# EasyEDA schematic 1-Schematic_EE463_Project.json
TITLE: DC Motor Drive; REV: 2.1; Date: 2022-02-06; Sheet: 1/1; Drawn By: zehragunes.13; Company: Enjin Drivers
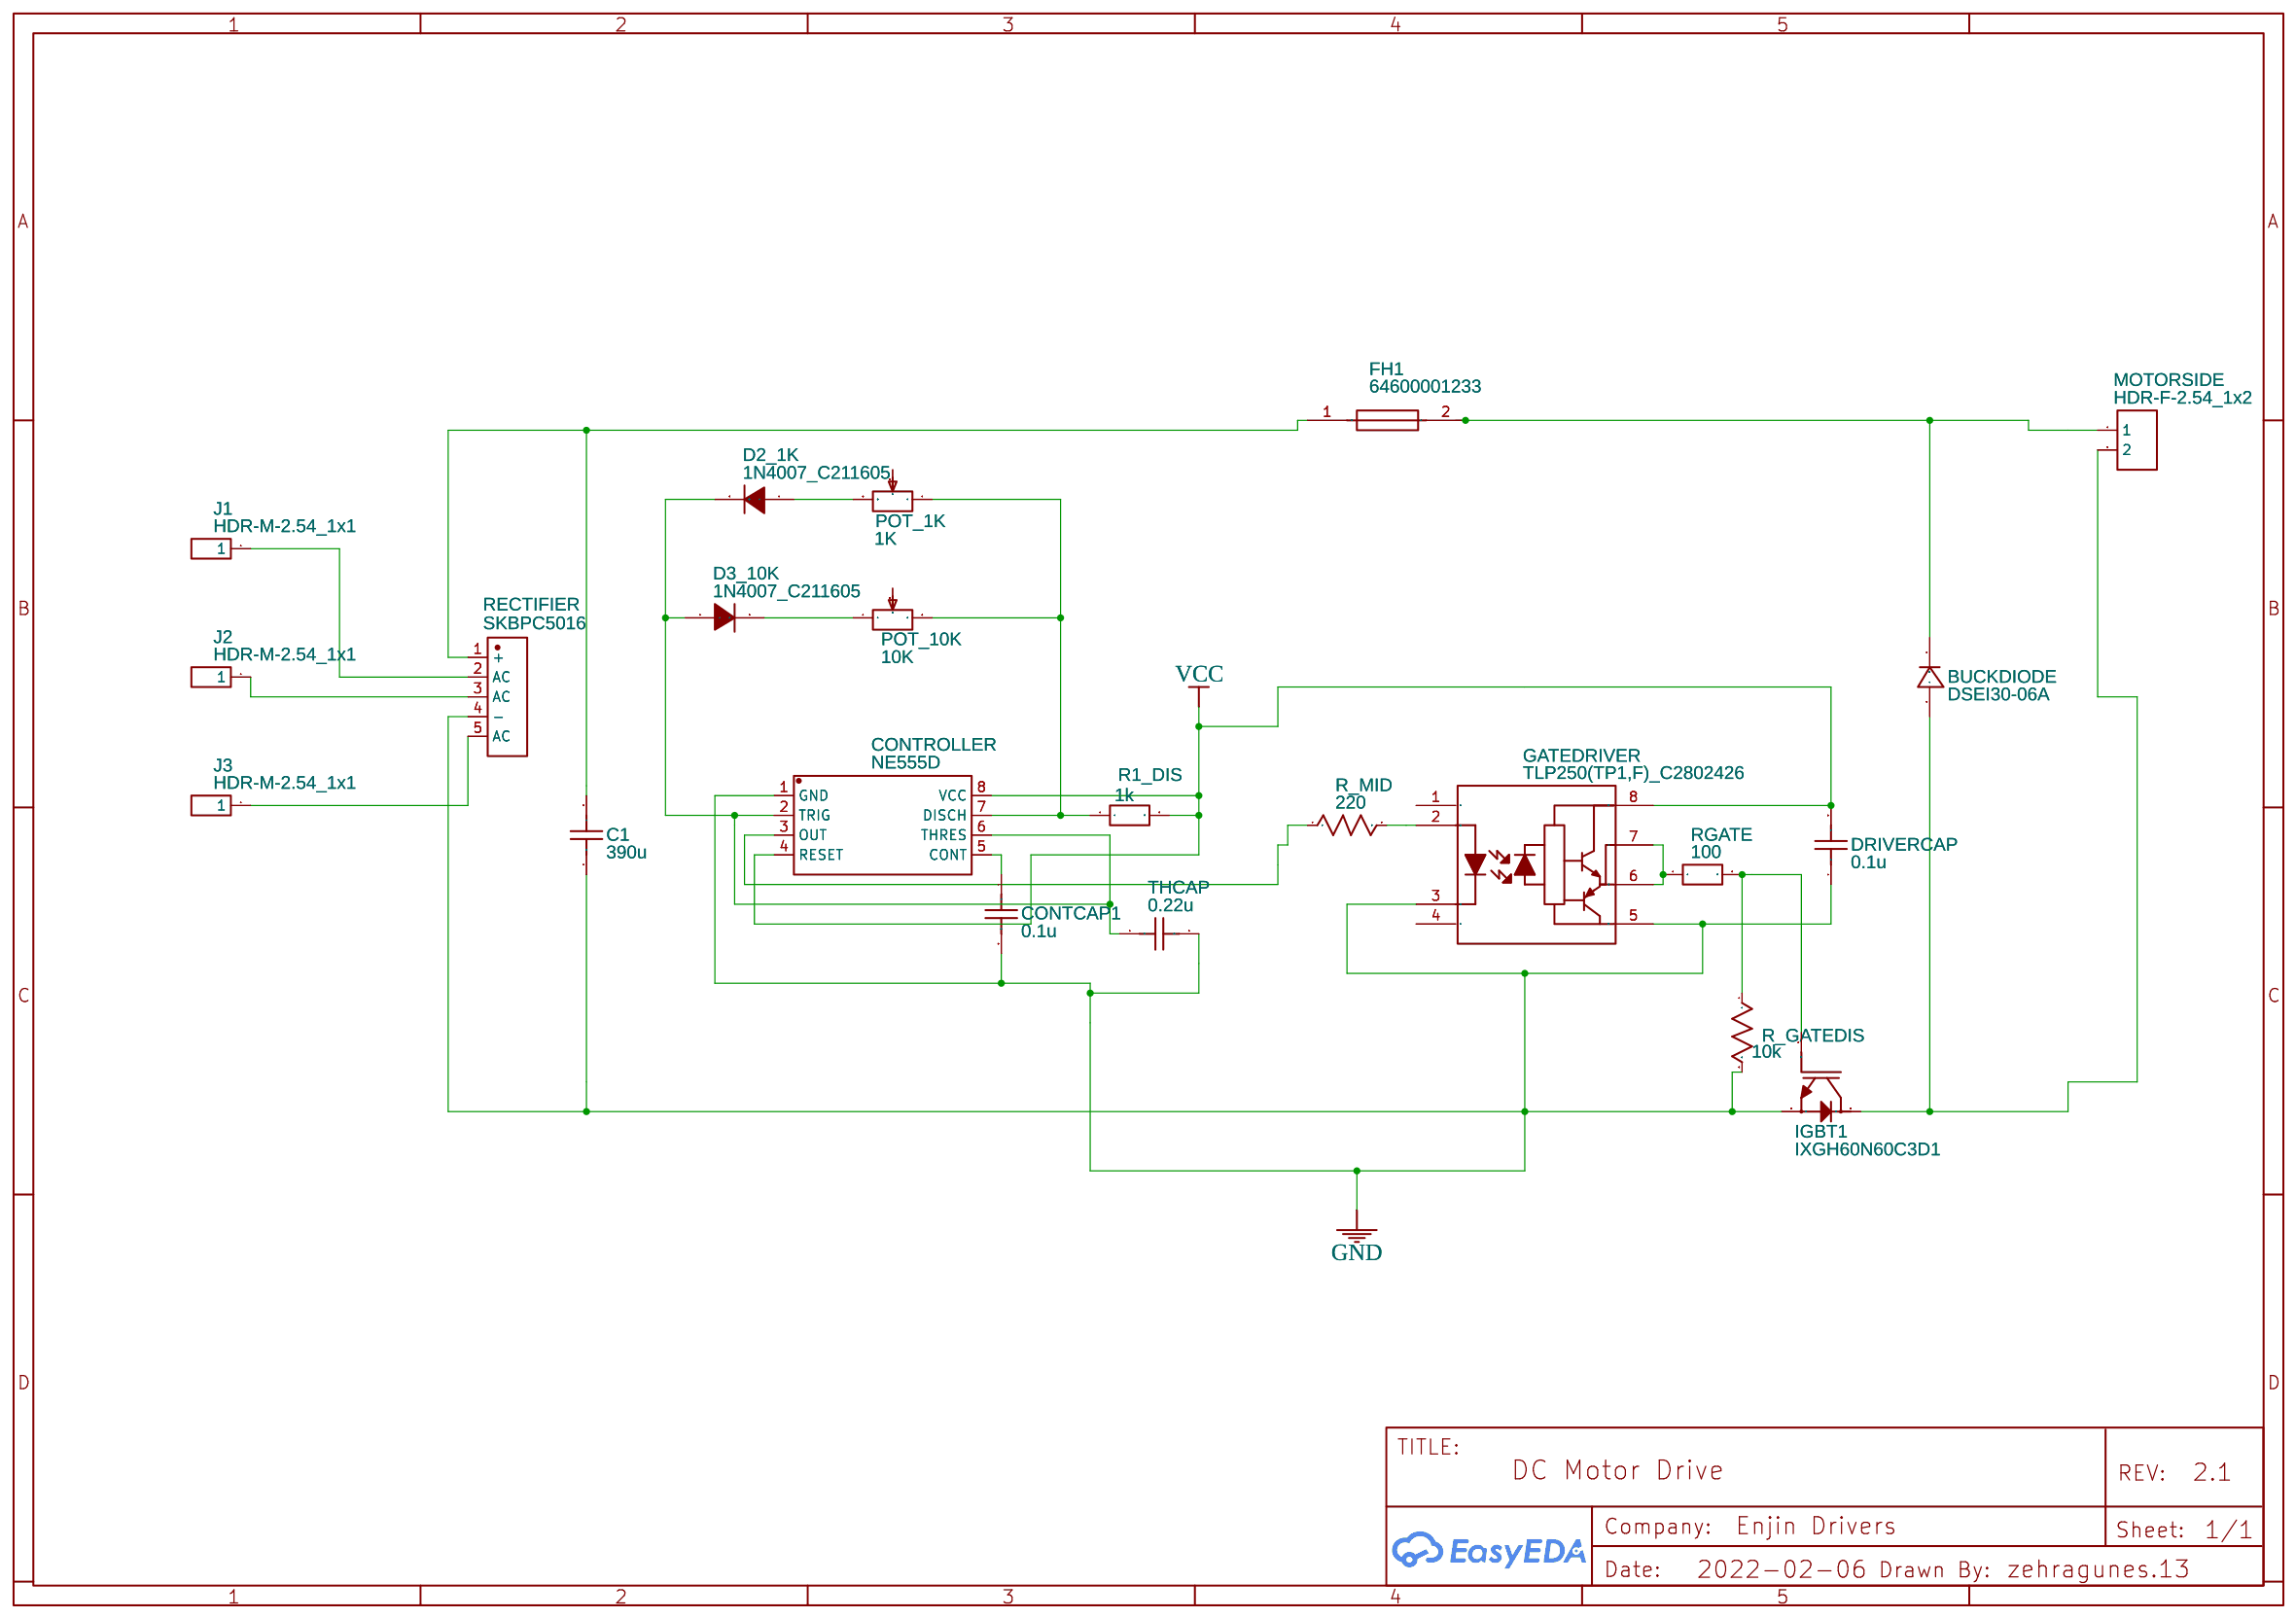
[diagram p0: schematic sheet]

## Parts
BUCKDIODE  DSEI30-06A  [TO-247-2_L15.8-W5.0-P10.92-L]
C1  390u  [C0603]
CONTCAP1  0.1u  [C0603]
CONTROLLER  NE555D  [SOIC-8_L5.0-W4.0-P1.27-LS6.0-BL]
D2_1K  1N4007_C211605  [DO-41_BD2.4-L4.7-P8.70-D0.9-FD]
D3_10K  1N4007_C211605  [DO-41_BD2.4-L4.7-P8.70-D0.9-FD]
DRIVERCAP  0.1u  [C0603]
FH1  64600001233  [FUSE-TH_64600001233]
GATEDRIVER  TLP250(TP1,F)_C2802426  [OPTO-SMD-8P_L9.6-W6.5-P2.54-LS10.0-BL]
IGBT1  IXGH60N60C3D1  [TO-247-3_L15.9-W5.1-P5.44-L]
J1  HDR-M-2.54_1x1  [HDR-M-2.54_1X1]
J2  HDR-M-2.54_1x1  [HDR-M-2.54_1X1]
J3  HDR-M-2.54_1x1  [HDR-M-2.54_1X1]
MOTORSIDE  HDR-F-2.54_1x2  [HDR-F-2.54_1X2]
POT_1K  1K  [RES-ADJ-SMD_EVM3X3]
POT_10K  10K  [RES-SMD_EVM2GS]
R1_DIS  1k  [R0201]
R_GATEDIS  10k  [R0603]
R_MID  220  [R0603]
RECTIFIER  SKBPC5016  [DIO-BG-TH_SKBPC5016]
RGATE  100  [R0201]
THCAP  0.22u  [C0603]

## Library data of the parts
BUCKDIODE = DSEI30-06A: Supplier: LCSC; Supplier Part: C424091; Manufacturer: IXYS; Contributor: LCSC; JLCPCB Part Class: Extended Part
C1 CONTCAP1 DRIVERCAP THCAP = C_0603_US: Contributor: LCEDA_Lib
CONTROLLER = NE555D: Supplier: LCSC; Supplier Part: C234230; Manufacturer: Texas Instruments; Contributor: LCSC; JLCPCB Part Class: Extended Part
D2_1K D3_10K = 1N4007_C211605: Supplier: LCSC; Supplier Part: C211605; Manufacturer: Yangzhou Yangjie Elec Tech; Manufacturer Part: 1N4007; Contributor: LCSC; JLCPCB Part Class: Extended Part
FH1 = 64600001233: Supplier: LCSC; Supplier Part: C2760106; Manufacturer: Littelfuse(美国力特); JLCPCB Part Class: Extended Part; Contributor: LCSC
GATEDRIVER = TLP250(TP1,F)_C2802426: Supplier: LCSC; Supplier Part: C2802426; Manufacturer: TOSHIBA(东芝); Manufacturer Part: TLP250(TP1,F); Contributor: LCSC; JLCPCB Part Class: Extended Part
IGBT1 = IXGH60N60C3D1: Supplier: LCSC; Supplier Part: C497181; Manufacturer: IXYS; Contributor: LCSC; JLCPCB Part Class: Extended Part
J1-J3 = HDR-M-2.54_1x1: Supplier Part: C81276; Supplier: LCSC; Contributor: LCEDA_Lib
MOTORSIDE = HDR-F-2.54_1x2: Supplier Part: C49661; Supplier: LCSC; Contributor: LCEDA_Lib
POT_1K = EVM3ESX50B13: Supplier: LCSC; Manufacturer: PANASONIC; Supplier Part: C11952
POT_10K = EVM2GSX80B14: Supplier: LCSC; Manufacturer: PANASONIC; Supplier Part: C72381
R1_DIS RGATE = R_0201_EU: Contributor: LCEDA_Lib
R_GATEDIS R_MID = R_0603_US: Contributor: LCEDA_Lib
RECTIFIER = SKBPC5016: Supplier: LCSC; Supplier Part: C781432; Manufacturer: YANGJIE(扬杰); JLCPCB Part Class: Extended Part; Contributor: LCSC

## Nets
GND: C1.1 CONTCAP1.2 CONTROLLER.1(GND) DRIVERCAP.1 GATEDRIVER.3 GATEDRIVER.5(GND) IGBT1.3(E) R_GATEDIS.2 RECTIFIER.4(-) THCAP.2
VCC: CONTROLLER.4(RESET) CONTROLLER.8(VCC) DRIVERCAP.2 GATEDRIVER.8(VCC) R1_DIS.2
Net-(BUCKDIODE-1): BUCKDIODE.1(C) FH1.2 MOTORSIDE.1
Net-(BUCKDIODE-3): BUCKDIODE.3(A) IGBT1.2(C) MOTORSIDE.2
Net-(C1-2): C1.2 FH1.1 RECTIFIER.1(+)
Net-(CONTCAP1-1): CONTCAP1.1 CONTROLLER.5(CONT)
Net-(CONTROLLER-2): CONTROLLER.2(TRIG) CONTROLLER.6(THRES) D2_1K.2(C) D3_10K.1(A) THCAP.1
Net-(CONTROLLER-3): CONTROLLER.3(OUT) R_MID.1
Net-(CONTROLLER-7): CONTROLLER.7(DISCH) POT_1K.1 POT_10K.3 R1_DIS.1
Net-(D2_1K-1): D2_1K.1(A) POT_1K.3
Net-(D3_10K-2): D3_10K.2(C) POT_10K.1
Net-(GATEDRIVER-2): GATEDRIVER.2 R_MID.2
Net-(GATEDRIVER-6): GATEDRIVER.6 GATEDRIVER.7 RGATE.1
Net-(IGBT1-1): IGBT1.1(G) R_GATEDIS.1 RGATE.2
Net-(J1-1): J1.1 RECTIFIER.2(AC)
Net-(J2-1): J2.1 RECTIFIER.3(AC)
Net-(J3-1): J3.1 RECTIFIER.5(AC)

Not connected (* = marked no-connect by the designer): GATEDRIVER 1 4; POT_1K 2; POT_10K 2
